# Altium schematic sheet Preamp_protection.SchDoc
size A4
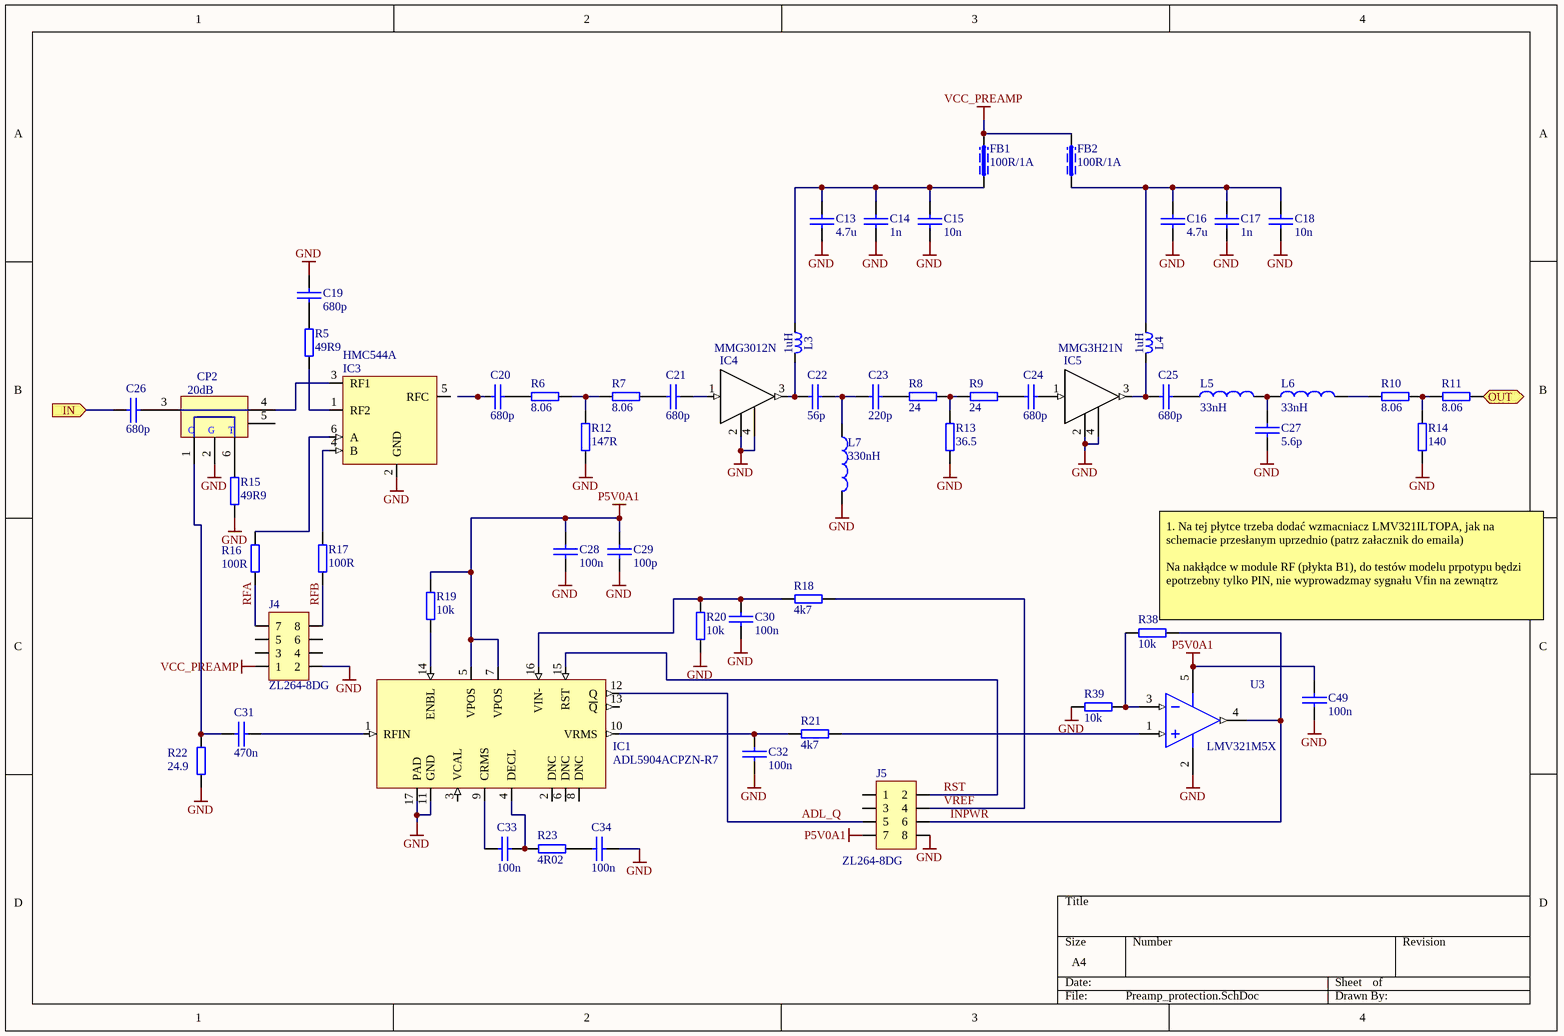
[diagram p0: Preamp_protection.SchDoc]

## Parts
C13  4.7u  [0603C]
C14  1n  [0603C]
C15  10n  [0603C]
C16  4.7u  [0603C]
C17  1n  [0603C]
C18  10n  [0603C]
C19  680p  [0603C]
C20  680p  [0603C]
C21  680p  [0603C]
C22  56p  [0603C]
C23  220p  [0603C]
C24  680p  [0603C]
C25  680p  [0603C]
C26  680p  [0603C]
C27  5.6p  [0603C]
C28  100n  [0603C]
C29  100p  [0603C]
C30  100n  [0603C]
C31  470n  [0603C]
C32  100n  [0603C]
C33  100n  [0603C]
C34  100n  [0603C]
C49  100n  [0603C]
CP2  20dB  [XFMR_MINI-CIRCUITS_AT224]
FB1  100R/1A  [0603L]
FB2  100R/1A  [0603L]
IC1  ADL5904ACPZN-R7  [QFN50P300X300X80_HS-17N]
IC3  HMC544A  [SOT95P280X130-6N]
IC4  MMG3012N  [SOT89-150P410X170-3N]
IC5  MMG3H21N  [SOT89-150P410X170-3N]
J4  ZL264-8DG  [ZL264-8DG]
J5  ZL264-8DG  [ZL264-8DG]
L3  1uH  [INDP2520X18L]
L4  1uH  [INDP2520X18L]
L5  33nH  [0603L]
L6  33nH  [0603L]
L7  330nH  [0603L]
R5  49R9  [0603R]
R6  8.06  [0603R]
R7  8.06  [0603R]
R8  24  [0603R]
R9  24  [0603R]
R10  8.06  [0603R]
R11  8.06  [0603R]
R12  147R  [0603R]
R13  36.5  [0603R]
R14  140  [0603R]
R15  49R9  [0603R]
R16  100R  [0603R]
R17  100R  [0603R]
R18  4k7  [0603R]
R19  10k  [0603R]
R20  10k  [0603R]
R21  4k7  [0603R]
R22  24.9  [0603R]
R23  4R02  [0603R]
R38  10k  [0603R]
R39  10k  [0603R]
U3  LMV321M5X  [DBV0005A_N]

## Ports
IN (in), OUT (out)

## Nets
GND: C13.2 C14.2 C15.2 C16.2 C17.2 C18.2 C19.2 C27.1 C28.2 C29.2 C30.1 C32.1 C34.2 C49.1 CP2.2(NC) IC1.11(GND) IC1.17(PAD) IC3.2(GND) IC4.2(G) IC4.4(G) IC5.2(G) IC5.4(G) J4.2 J5.8 L7.2 R12.1 R13.2 R14.2 R15.2 R20.1 R22.2 R39.2 U3.2(V-)
P5V0A1: C28.1 C29.1 C49.2 IC1.5(VPOS) IC1.7(VPOS) J5.7 R19.1 U3.5(V+)
VCC_PREAMP: FB1.2 FB2.2 J4.1
ADL_Q: IC1.12(Q) J5.5
IN: C26.1 ; port IN
INPWR: J5.6 R38.1 U3.4(OUT)
OUT: R11.1 ; port OUT
RFA: J4.7 R16.2
RFB: J4.8 R17.2
RST: IC1.15(RST) J5.2
VREF: J5.4 R18.1
NetC13_1: C13.1 C14.1 C15.1 FB1.1 L3.1
NetC16_1: C16.1 C17.1 C18.1 FB2.1 L4.1
NetC19_1: C19.1 R5.1
NetC20_2: C20.2 R6.2
NetC21_1: C21.1 R7.1
NetC21_2: C21.2 IC4.1(IN)
NetC22_1: C22.1 IC4.3(OUT) L3.2
NetC22_2: C22.2 C23.1 L7.1
NetC23_2: C23.2 R8.2
NetC24_1: C24.1 R9.1
NetC24_2: C24.2 IC5.1(IN)
NetC25_1: C25.1 IC5.3(OUT) L4.2
NetC25_2: C25.2 L5.1
NetC26_2: C26.2 CP2.3(S)
NetC27_2: C27.2 L5.2 L6.1
NetC30_2: C30.2 IC1.16(VIN-) R18.2 R20.2
NetC31_1: C31.1 CP2.1(SDOT) R22.1
NetC31_2: C31.2 IC1.1(RFIN)
NetC32_2: C32.2 IC1.10(VRMS) R21.2
NetC33_1: C33.1 IC1.9(CRMS)
NetC33_2: C33.2 IC1.4(DECL) R23.1
NetC34_1: C34.1 R23.2
NetCP2_4: CP2.4(P) IC3.3(RF1)
NetCP2_6: CP2.6(PDOT) R15.1
NetIC1_14: IC1.14(ENBL) R19.2
NetIC3_1: IC3.1(RF2) R5.2
NetIC3_4: IC3.4(B) R17.1
NetIC3_6: IC3.6(A) R16.1
NetL6_2: L6.2 R10.2
NetR6_1: R6.1 R7.2 R12.2
NetR8_1: R8.1 R9.2 R13.1
NetR10_1: R10.1 R11.2 R14.1
NetR21_1: R21.1 U3.1(IN+)
NetR38_2: R38.2 R39.1 U3.3(IN-)

Not connected (* = marked no-connect by the designer): C20 1; CP2 5(P); IC1 2(DNC) 3(VCAL) 6(DNC) 8(DNC) 13(~{Q}); IC3 5(RFC); J4 3 4 5 6; J5 1 3

## Notes on the sheet
- (near R38) 1. Na tej płytce trzeba dodać wzmacniacz LMV321ILTOPA, jak na schemacie przesłanym uprzednio (patrz załacznik do emaila)
  Na nakłądce w module RF (płykta B1), do testów modelu prpotypu będzi epotrzebny tylko PIN, nie wyprowadzmay sygnału Vfin na zewnątrz
- (in symbol RF_Coupler_TCD-20-4X) C; G; T

## Library data of the parts
C13 C16 = CAP_SMD_0603: Capacitor SMD; Part: GRM21BR71C475KE51L; Supplier 1: Digi-Key; Supplier Part Number 1: 490-1524-2-ND
C14 C17 = CAP_SMD_0603: Capacitor SMD; Part: GRM1885C1H102JA01D; Supplier 1: Digi-Key; Supplier Part Number 1: 490-1524-2-ND
C15 C18 = CAP_SMD_0603: Capacitor SMD; Part: GRM1885C1H103JA01D; Supplier 1: Digi-Key; Supplier Part Number 1: 490-1524-2-ND
C19-C21 C24-C26 = CAP_SMD_0603: Capacitor SMD; Part: GRM1555C1H681GA01; Supplier 1: Digi-Key; Supplier Part Number 1: 490-1524-2-ND
C22 = CAP_SMD_0603: Capacitor SMD; Part: GRM1885C1H560GA01J; Supplier 1: Digi-Key; Supplier Part Number 1: 490-1524-2-ND
C23 = CAP_SMD_0603: Capacitor SMD; Part: GRM1885C1H221GA01D; Supplier 1: Digi-Key; Supplier Part Number 1: 490-1524-2-ND
C27 = CAP_SMD_0603: Capacitor SMD; Part: GQM1885C2A5R6BB01D; Supplier 1: Digi-Key; Supplier Part Number 1: 490-1524-2-ND
C28 C30 C32-C34 C49 = CAP_SMD_0603: Capacitor SMD; Part: GRM188L81H104KA93D; Supplier 1: Digi-Key
  C28 C30 C32-C34: Supplier Part Number 1: 490-1524-2-ND
C29 = CAP_SMD_0603: Capacitor SMD; Part: C1608NP01H101J080AA; Supplier 1: Digi-Key; Supplier Part Number 1: 490-1524-2-ND
C31 = CAP_SMD_0603: Capacitor SMD; Part: GRM188R71A474KA61D; Supplier 1: Digi-Key; Supplier Part Number 1: 490-1524-2-ND
CP2 = RF_Coupler_TCD-20-4X: 50 Ohms directional coupler; Part Number: XFMR_MINI-CIRCUITS_TCD-20-4X+; Part Description: 50 Ohms 4.5 To 3000MHz RF Transformer; Manufacturer: MINI-CIRCUITS; Manufacturer Part Number: TCD-20-4X+; Component Kind: Standard; Component Type: Standard; Pin Count: 5; Value: 20dB; Status: None; Mounted: Yes; Socket: No; Sense: No; SMD: Yes; ComponentHeight: 3.81mm; HelpURL: \\cern.ch\dfs\Applications\Altium\Datasheets\XFMR_MINI-CIRCUITS_TC1-1-13M+.pdf; Author: GK; CreateDate: 30.11.2011; LatestRevisionDate: 30.11.2011
FB1 FB2 = L_FERRITE_BEAD_0603: ferrite bead 100R@100MHz 1A; Supplier 1: Newark; Supplier Part Number 1: 89R3144
IC1 = ADL5904: DC   to 6 GHz  , 45 dB DC  to 6 GHz , 45 dB TruPwr Detector with Envelope Threshold Detection
IC3 = RF_HMC544AE
IC4 = RF_MMG3012N: Broadband High Linearity Amplifier
IC5 = RF_MMG3H21N: Broadband High Linearity Amplifier
J4 J5 = CON_2X4 2.54 SMT FEM: 2.54mm pitch connector
L3 L4 = L_1008_100u: 100uH, 60mA, 21R; Part: LQW2UAS1R0J00L; Case: 1008; SMD: Yes; Author: GK
L5 L6 = L_0603_1uH: 1uH, 25mA, 0.6R; Part: LQW18AS33NG00D; Supplier 1: Newark; Supplier Part Number 1: 42M2122
L7 = L_0603_1uH: 1uH, 25mA, 0.6R; Part: LQW18ANR33G00D; Supplier 1: Newark; Supplier Part Number 1: 42M2122
R5 R15 = RES_0603: SMD Resistor; Part: MCT0603PD4999DP500; Supplier 1: Newark; Supplier Part Number 1: 39K0073
R6 R7 R10 R11 = RES_0603: SMD Resistor; Part: CPF0805B8R06E1; Supplier 1: Newark; Supplier Part Number 1: 39K0073
R8 R9 = RES_0603: SMD Resistor; Part: CPF0805B24RE1; Supplier 1: Newark; Supplier Part Number 1: 39K0073
R12 = RES_0603: SMD Resistor; Part: CPF0805B147RE1; Supplier 1: Newark; Supplier Part Number 1: 39K0073
R13 = RES_0603: SMD Resistor; Part: CPF0805B36R5E1; Supplier 1: Newark; Supplier Part Number 1: 39K0073
R14 = RES_0603: SMD Resistor; 140: CPF0805B147RE1; Supplier 1: Newark; Supplier Part Number 1: 39K0073
R16 R17 = RES_0603: SMD Resistor; Part: CRCW0603100RJNEA; Supplier 1: Newark; Supplier Part Number 1: 39K0073
R18 R21 = RES_0603: SMD Resistor; Part: CR0603-FX-4701ELF; Supplier 1: Newark; Supplier Part Number 1: 39K0073
R19 R20 R38 R39 = RES_0603: SMD Resistor; Part: CRCW060310K0FKEA; Supplier 1: Newark; Supplier Part Number 1: 39K0073
R22 = RES_0603: SMD Resistor; Part: CPF0603F24R9C1; Supplier 1: Newark; Supplier Part Number 1: 39K0073
R23 = RES_0603: SMD Resistor; Part: CRCW06034R02FKEA; Supplier 1: Newark; Supplier Part Number 1: 39K0073
U3 = CMP-0055-01048-3: General Purpose, Low Voltage, Rail-to-Rail Output Operational Amplifiers, 5-pin SOT-23; Manufacturer: Texas Instruments; PackageTopMarking: A13*XTT; PowerWise: N; Package Reference: DBV0005A; PackageDescription: Molded SOT-23, .115 x .063 x .040 in Body, 5 Lead, .0375 in Pitch; CompType: Amplifiers; RoHS: N; ComponentLink1URL: http://www.ti.com/general/docs/lit/getliterature.tsp?genericPartNumber=LMV321-N&fileType=pdf; PinCount: 5; ComponentLink1Description: Datasheet URL